# Altium schematic sheet Display.SchDoc
size A4; SheetNumber: 5; SheetTotal: 5
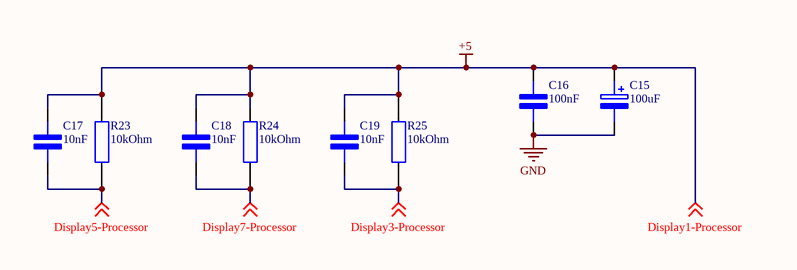
[diagram p0: Display.SchDoc]

## Parts
C15  100uF  [100uF capacitor]
C16  100nF  [5mm lead spacing capacitor]
C17  10nF  [5mm lead spacing capacitor]
C18  10nF  [5mm lead spacing capacitor]
C19  10nF  [5mm lead spacing capacitor]
R23  10kOhm  [resistor]
R24  10kOhm  [resistor]
R25  10kOhm  [resistor]

## Nets
+5: C15.1(+) C16.2(-) C17.2(-) C18.2(-) C19.2(-) R23.2 R24.2 R25.2 ; off-sheet Display1-Processor  [also labelled Display1-Processor]
GND: C15.2(-) C16.1(+)
Display3-Processor: C19.1(+) R25.1 ; off-sheet Display3-Processor
Display5-Processor: C17.1(+) R23.1 ; off-sheet Display5-Processor
Display7-Processor: C18.1(+) R24.1 ; off-sheet Display7-Processor

## Library data of the parts
C15 = 100uF: Capacitor Polarised; Manufacturer_Name: Kemet; Manufacturer_Part_Number: ESK107M050AG3EA; Height: 12.5mm
C16 = 100nF: Capacitor; Manufacturer_Name: Nichicon; Manufacturer_Part_Number: UVR1H472MRD; Datasheet Link: https://www.mouser.co.uk/datasheet/2/293/e-vr-6088.pdf; Height: 42mm
C17-C19 = 10nF: Capacitor; Manufacturer_Name: Nichicon; Manufacturer_Part_Number: UVR1H472MRD; Datasheet Link: https://www.mouser.co.uk/datasheet/2/293/e-vr-6088.pdf; Height: 42mm
R23-R25 = 10kOhm: Resistor; Manufacturer_Name: YAGEO (PHYCOMP); Manufacturer_Part_Number: CFR-25JT-52-10K